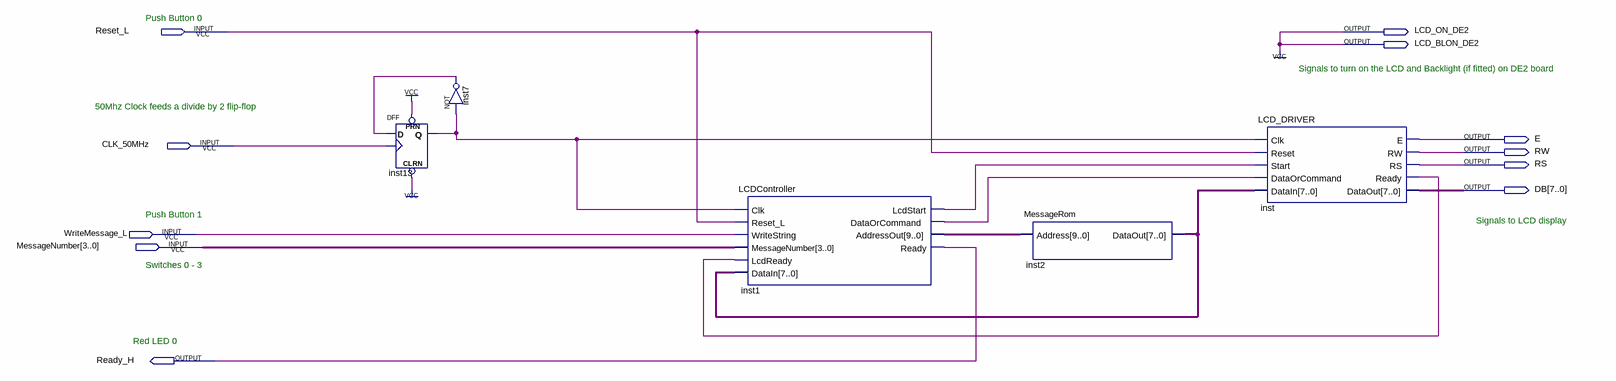
[diagram p0: schematic sheet]
// Quartus schematic LCD_Display.bdf as structural Verilog: 5 symbols, 11 pins
module LCD_Display (
  input  Reset_L,
  input  CLK_50MHz,
  input  WriteMessage_L,
  input  [3:0] MessageNumber,
  output LCD_ON_DE2,
  output LCD_BLON_DE2,
  output E,
  output RW,
  output RS,
  output [7:0] DB,
  output Ready_H
);

  wire inst1_dataorcommand, inst1_lcdstart, inst7_out, inst13_q, inst_ready;
  wire [7:0] inst2_dataout;
  wire [9:0] inst1_addressout;

  DFF inst13 (.CLRN(1'b1), .CLK(CLK_50MHz), .D(inst7_out), .PRN(1'b1), .Q(inst13_q));
  not inst7 (inst7_out, inst13_q);
  LCDController inst1 (
    .Clk(inst13_q), .Reset_L(Reset_L), .WriteString(WriteMessage_L), .MessageNumber(MessageNumber),
    .LcdReady(inst_ready), .DataIn(inst2_dataout), .LcdStart(inst1_lcdstart),
    .DataOrCommand(inst1_dataorcommand), .AddressOut(inst1_addressout), .Ready(Ready_H));
  MessageRom inst2 (.Address(inst1_addressout), .DataOut(inst2_dataout));
  LCD_DRIVER inst (
    .Clk(inst13_q), .Reset(Reset_L), .Start(inst1_lcdstart), .DataOrCommand(inst1_dataorcommand),
    .DataIn(inst2_dataout), .E(E), .RW(RW), .RS(RS), .Ready(inst_ready), .DataOut(DB));

  assign LCD_BLON_DE2 = 1'b1;
  assign LCD_ON_DE2 = 1'b1;

  // Notes on the sheet:
  //   Push Button 0
  //   Signals to turn on the LCD and Backlight (if fitted) on DE2 board
  //   50Mhz Clock feeds a divide by 2 flip-flop
  //   Push Button 1
  //   Signals to LCD display
  //   Switches 0 - 3
  //   Red LED 0
endmodule
